# Altium schematic sheet 20vbt-based-mixer.SchDoc
size A; SheetNumber: 2; SheetTotal: 2
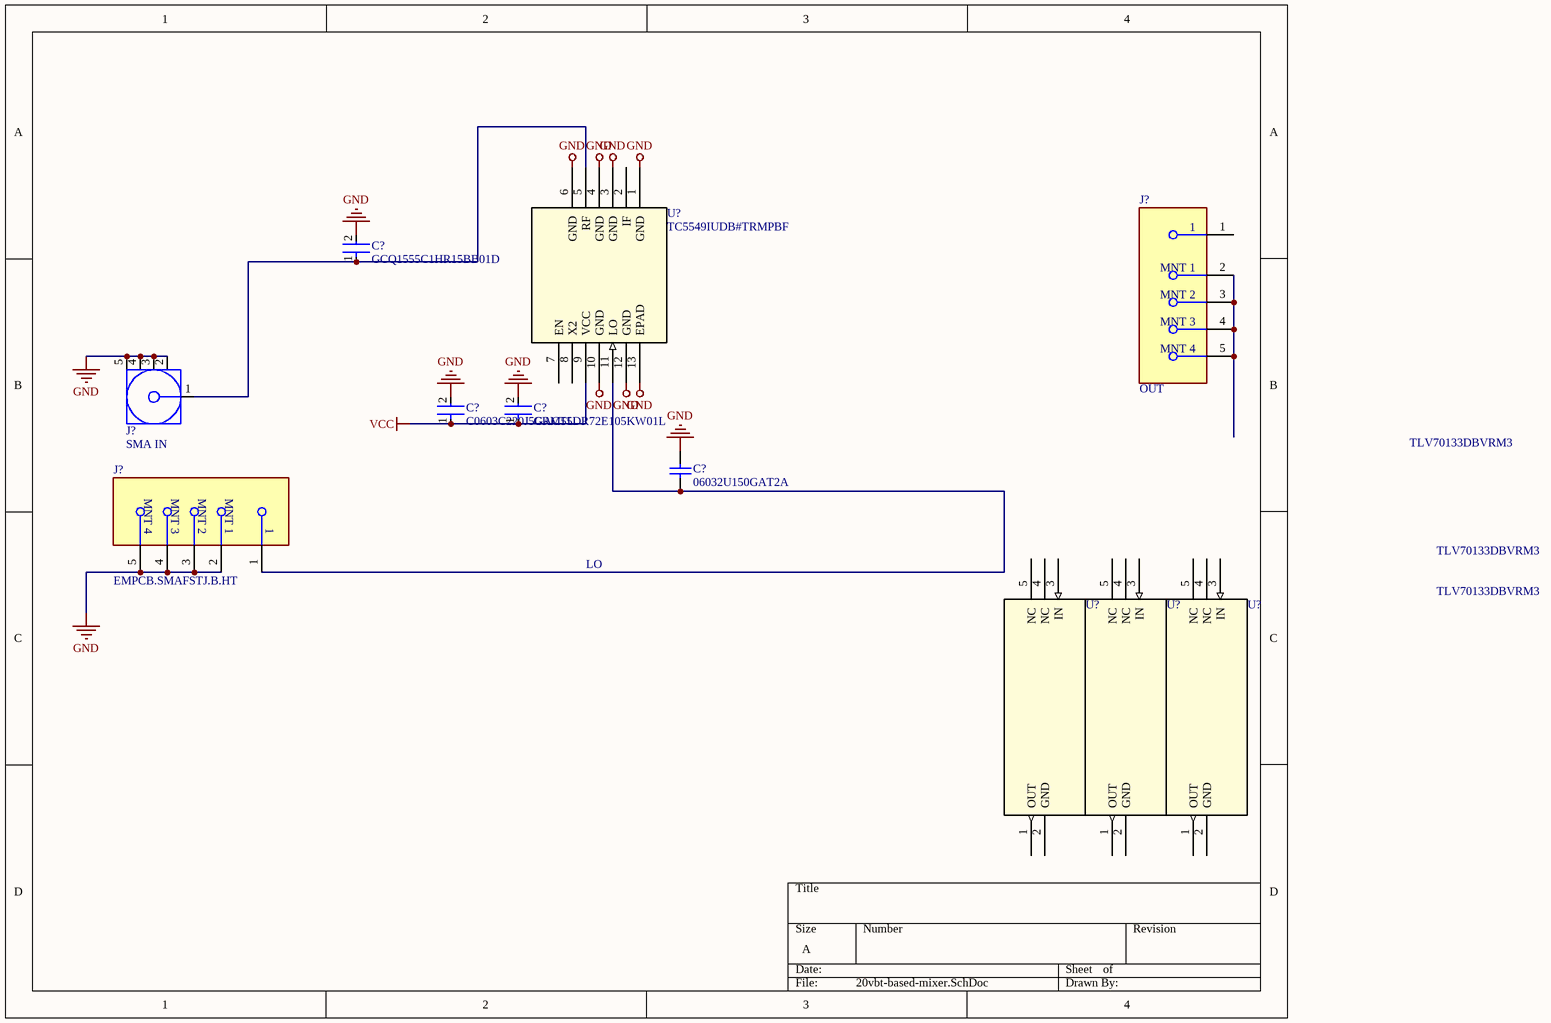
[diagram p0: 20vbt-based-mixer.SchDoc]

## Parts
(Parts that share a designator on the sheet are numbered #1, #2 ... from top to bottom, then left to right.)
C?#1  GCQ1555C1HR15BB01D  [FP-GCQ155-0_05-MFG]
C?#2  C0603C220J5GACTU  [FP-C0603C-CF-MFG]
C?#3  GRM55DR72E105KW01L  [FP-GRM55D-0_4-IPC_A]
C?#4  06032U150GAT2A  [CAPC1508X91X25LL25T13]
J?#1  OUT  [FP-EMPCB_SMAFSTJ_B_HT-MFG]
J?#2  SMA IN  [MOLX-731000114_V]
J?#3  EMPCB.SMAFSTJ.B.HT  [FP-EMPCB_SMAFSTJ_B_HT-MFG]
U?#1  TC5549IUDB#TRMPBF  [LTC5549IUDBTRMPBF_ADI]
U?#2  TLV70133DBVRM3  [DBV5]
U?#3  TLV70133DBVRM3  [DBV5]
U?#4  TLV70133DBVRM3  [DBV5]

## Nets
GND: C?#1.2 C?#2.2 C?#3.2 C?#4.1 J?#2.2 J?#2.3 J?#2.4 J?#2.5 J?#3.2(MNT_1) J?#3.3(MNT_2) J?#3.4(MNT_3) J?#3.5(MNT_4) U?#1.1(GND) U?#1.3(GND) U?#1.4(GND) U?#1.6(GND) U?#1.10(GND) U?#1.12(GND) U?#1.13(EPAD)
VCC: C?#2.1 C?#3.1 U?#1.9(VCC)
NetC?#1_1: C?#1.1 J?#2.1 U?#1.5(RF)
NetC?#4_2: C?#4.2 J?#3.1 U?#1.11(LO)
NetJ?#1_2: J?#1.2(MNT_1) J?#1.3(MNT_2) J?#1.4(MNT_3) J?#1.5(MNT_4)

Not connected (* = marked no-connect by the designer): J?#1 1; U?#1 2(IF) 7(EN) 8(X2); U?#2 1(OUT) 2(GND) 3(IN) 4(NC) 5(NC); U?#3 1(OUT) 2(GND) 3(IN) 4(NC) 5(NC); U?#4 1(OUT) 2(GND) 3(IN) 4(NC) 5(NC)

## Notes on the sheet
- LO

## Library data of the parts
C?#1 = CMP-06035-056453-1: High Q Ceramic Capacitor for Automotive 0.15pF ±0.1pF 50VDC C0G 0402 Paper T/R
C?#2 = CMP-2006-03119-3: Cap Ceramic 22pF 50V C0G 5% SMD 0603 125°C Paper T/R; Manufacturer: KEMET; Temperature Coefficient: 30ppm/°C; Automotive Grade: Grade 1; Tolerance: 0.05; RoHS: TRUE; Temperature Characteristic: C0G; Capacitance: 22 pF; Device Class L3: Ceramic Capacitors; Digikey Description: Cap Ceramic 22pF 50V C0G 5% SMD 0603 125°C Paper T/R; ComponentLink2URL: https://api.kemet.com/component-edge/download/datasheet/C0603C100J5GACAUTO.pdf; ComponentLink2Description: Datasheet; Automotive: Yes; Temperature: -55°C to +125°C; Temperature Range High: +125°C; Package: C0603C-CF; Device Class L1: Passive Components; Device Class L2: Capacitors; Lead Free: Yes; Value: 22 pF; Manufacturer Part Number: C0603C220J5GACTU; Category: Cap; Mouser Description: Cap Ceramic 22pF 50V C0G 5% SMD 0603 125°C Paper T/R; Voltage Rating: 50 V; Height: 0.87mm; Material: Ceramic; Temperature Range Low: -55°C; Octopart: https://octopart.com/c0603c220j5gactu-kemet-98525
C?#3 = CMP-2000-06370-2: Chip Multilayer Ceramic Capacitors for General Purpose, 2220, 1.0uF, X7R, 15%, 10%, 250V; Capacitance: 1uF; Width: 5mm; Height: 2mm; Case Code (Imperial): 2220; Voltage Rating (DC): 250V; Max Operating Temperature: 125°C; Number of Pins: 2; Min Operating Temperature: -55°C; Termination: SMD/SMT; Case/Package: 2220; Dielectric: X7R; Material: Ceramic; REACH SVHC: No SVHC; Voltage: 250V; Packaging: Tape and Reel; Thickness: 0.087inch; Depth: 5mm; Package Quantity: 1; Tolerance: 10%; Mount: Surface Mount; Voltage Rating: 250V; Length: 5.7mm; Case Code (Metric): 5750; Lead Free: Lead Free
C?#4 = CMP-2006-04659-1: Manufacturer: AVX Interconnect / Elco; Part Number: 06032U150GAT2A
J?#1 = CMP-111093-000001-1: CONN SMA JACK STR 50OHM EDGE MNT; Manufacturer Part Number: EMPCB.SMAFSTJ.B.HT; Manufacturer: Taoglas Limited; Conn Orientation: Horizontal; Frequency: 12.4GHz; Impedance: 50Ω; Voltage Rating: 335V; Is Female: yes; Pitch: 2.62mm; Number Of Contacts: 1; Device Class L2: RF / Coaxial Connectors; Category: Conn; Contact Material: Gold; Device Class L1: Connectors; Digikey Description: CONN SMA JACK STR 50OHM EDGE MNT; Temperature Range Low: -40°C; Octopart: https://octopart.com/empcb.smafstj.b.ht-taoglas-24204431; ComponentLink2URL: https://cdn.taoglas.com/datasheets/EMPCB.SMAFSTJ.B.HT.pdf; Temperature Range High: +85°C; Device Class L3: unset; Temperature: -40°C to +85°C; Package: 0; RoHS: TRUE; Lead Free: Yes; Automotive: No; ComponentLink2Description: Datasheet; Mouser Description: RF Connectors / Coaxial Connectors SMA Straight Edge Mount PCB Jack-Gold
J?#2 = CMP-2000-05487-1: SMA Right-Angle PCB Jack Receptacle, Brass Body, Gold Plated, 50 Ohm, 5-Pin THD, RoHS, Tray; Manufacturer: Molex; Datasheet Version: 09/2016; Package Description: 5-Pin Through Hole Device, Body 14.8 x 6.35 mm, Pitch 2.54 mm; Datasheet URL: http://www.molex.com/webdocs/datasheets/pdf/en-us/0731000114_RF_COAX_CONNECTORS.pdf; Manufacturer URL: http://www.molex.com/; Package Reference: 731000114; Mounting Technology: ThroughHole; Package URL: http://www.molex.com/pdm_docs/sd/731000114_sd.pdf
J?#3 = CMP-111093-000001-1: CONN SMA JACK STR 50OHM EDGE MNT; Manufacturer: Taoglas Limited; Conn Orientation: Horizontal; Frequency: 12.4GHz; Impedance: 50Ω; Voltage Rating: 335V; Is Female: yes; Pitch: 2.62mm; Number Of Contacts: 1; Device Class L2: RF / Coaxial Connectors; Category: Conn; Contact Material: Gold; Device Class L1: Connectors; Digikey Description: CONN SMA JACK STR 50OHM EDGE MNT; Temperature Range Low: -40°C; Octopart: https://octopart.com/empcb.smafstj.b.ht-taoglas-24204431; ComponentLink2URL: https://cdn.taoglas.com/datasheets/EMPCB.SMAFSTJ.B.HT.pdf; Temperature Range High: +85°C; Device Class L3: unset; Temperature: -40°C to +85°C; Package: 0; RoHS: TRUE; Lead Free: Yes; Automotive: No; ComponentLink2Description: Datasheet; Mouser Description: RF Connectors / Coaxial Connectors SMA Straight Edge Mount PCB Jack-Gold; Manufacturer Part Number: EMPCB.SMAFSTJ.B.HT
U?#1 = LTC5549IUDBTRMPBF: No Description Available; Mfr_Name: Analog Devices Inc; Manufacturer_Part_Number: LTC5549IUDB#TRMPBF; Copyright: Copyright (C) 2024 Ultra Librarian. All rights reserved.; RefDes: RefDes; Type: DEV
U?#2-U?#4 = TLV70133DBVRM3: No Description Available; Mfr_Name: Texas Instruments; Copyright: Copyright (C) 2024 Ultra Librarian. All rights reserved.; Manufacturer_Part_Number: TLV70133DBVRM3; RefDes: RefDes; Type: DEV